# EAGLE design dds_ad9958 (EAGLE 6.5.0)
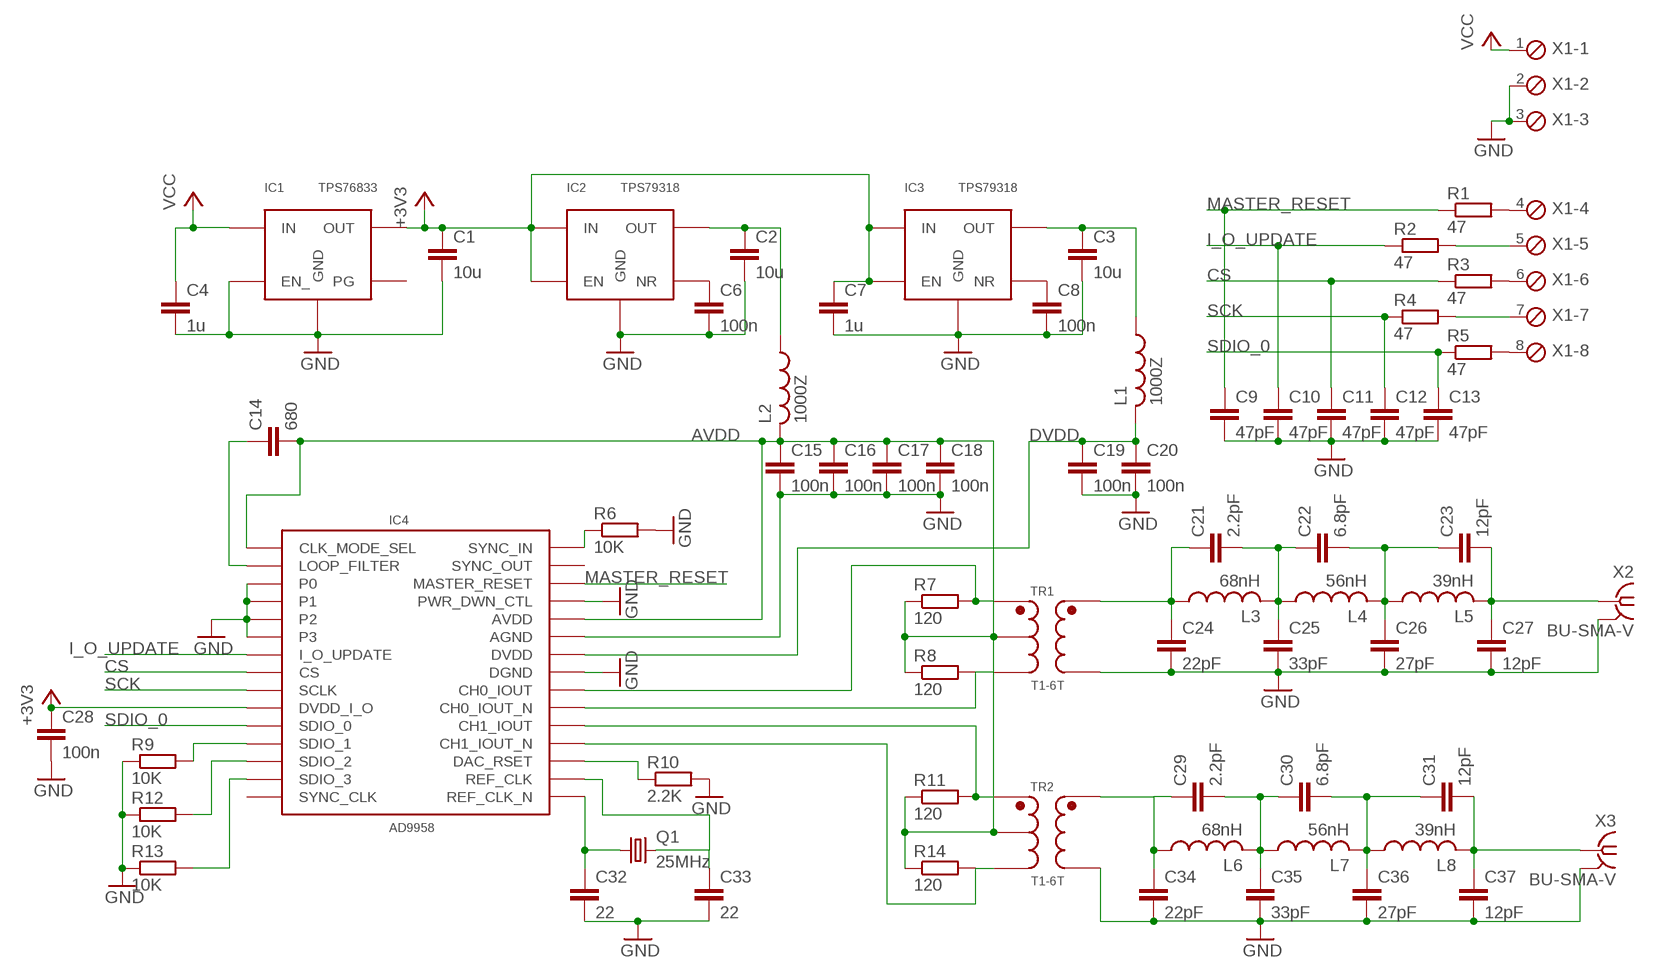
[diagram p0: schematic, sheet 1]

## Parts
C1  10u  C-EUC0805  [C0805]
C2  10u  C-EUC0805  [C0805]
C3  10u  C-EUC0805  [C0805]
C4  1u  C-EUC0603  [C0603]
C6  100n  C-EUC0603  [C0603]
C7  1u  C-EUC0603  [C0603]
C8  100n  C-EUC0603  [C0603]
C9  47pF  C-EUC0805  [C0805]
C10  47pF  C-EUC0805  [C0805]
C11  47pF  C-EUC0805  [C0805]
C12  47pF  C-EUC0805  [C0805]
C13  47pF  C-EUC0805  [C0805]
C14  680  C-EUC0805  [C0805]
C15  100n  C-EUC0603  [C0603]
C16  100n  C-EUC0603  [C0603]
C17  100n  C-EUC0603  [C0603]
C18  100n  C-EUC0603  [C0603]
C19  100n  C-EUC0603  [C0603]
C20  100n  C-EUC0603  [C0603]
C21  2.2pF  C-EUC0805  [C0805]
C22  6.8pF  C-EUC0805  [C0805]
C23  12pF  C-EUC0805  [C0805]
C24  22pF  C-EUC0805  [C0805]
C25  33pF  C-EUC0805  [C0805]
C26  27pF  C-EUC0805  [C0805]
C27  12pF  C-EUC0805  [C0805]
C28  100n  C-EUC0603  [C0603]
C29  2.2pF  C-EUC0805  [C0805]
C30  6.8pF  C-EUC0805  [C0805]
C31  12pF  C-EUC0805  [C0805]
C32  22  C-EUC0603  [C0603]
C33  22  C-EUC0603  [C0603]
C34  22pF  C-EUC0805  [C0805]
C35  33pF  C-EUC0805  [C0805]
C36  27pF  C-EUC0805  [C0805]
C37  12pF  C-EUC0805  [C0805]
IC1  TPS76833  TPS768XX  [SO8]
IC2  TPS79318  TPS793XX_FIXED  [SOT23-5]
IC3  TPS79318  TPS793XX_FIXED  [SOT23-5]
IC4  AD9958  [CP-56-1]
L1  1000Z  L-USL3225P  [L3225P]
L2  1000Z  L-USL3225P  [L3225P]
L3  68nH  L-USL0805  [C0805]
L4  56nH  L-USL0805  [C0805]
L5  39nH  L-USL0805  [C0805]
L6  68nH  L-USL0805  [C0805]
L7  56nH  L-USL0805  [C0805]
L8  39nH  L-USL0805  [C0805]
Q1  25MHz  CRYSTALHC49S  [HC49/S]
R1  47  R-EU_R0603  [R0603]
R2  47  R-EU_R0603  [R0603]
R3  47  R-EU_R0603  [R0603]
R4  47  R-EU_R0603  [R0603]
R5  47  R-EU_R0603  [R0603]
R6  10K  R-EU_R0603  [R0603]
R7  120  R-EU_R0603  [R0603]
R8  120  R-EU_R0603  [R0603]
R9  10K  R-EU_R0603  [R0603]
R10  2.2K  R-EU_R0603  [R0603]
R11  120  R-EU_R0603  [R0603]
R12  10K  R-EU_R0603  [R0603]
R13  10K  R-EU_R0603  [R0603]
R14  120  R-EU_R0603  [R0603]
TR1  T1-6T  [KK81]
TR2  T1-6T  [KK81]
X1  MPT8  [8POL254]
X2  BU-SMA-V  [BU-SMA-V]
X3  BU-SMA-V  [BU-SMA-V]

## Nets
+3V3: C1.1 C7.1 C28.1 IC1.5(OUT) IC1.6(OUT) IC2.1(IN) IC2.3(EN) IC3.1(IN) IC3.3(EN) IC4.P$49(DVDD_I_O)
AVDD: C14.2 C15.1 C16.1 C17.1 C18.1 IC4.P$5(AVDD) IC4.P$7(AVDD) IC4.P$11(AVDD) IC4.P$15(AVDD) IC4.P$19(AVDD) IC4.P$21(AVDD) IC4.P$24(CLK_MODE_SEL) IC4.P$26(AVDD) IC4.P$29(AVDD) IC4.P$30(AVDD) IC4.P$31(AVDD) IC4.P$33(AVDD) IC4.P$35(AVDD) IC4.P$36(AVDD) IC4.P$37(AVDD) IC4.P$39(AVDD) L2.2 R7.1 R8.1 R11.1 R14.1 TR1.P$2(SEC_CT) TR2.P$2(SEC_CT)
CS: C11.1 IC4.P$47(CS) R3.1
DVDD: C19.1 C20.1 IC4.P$45(DVDD) IC4.P$55(DVDD) L1.2
GND: C1.2 C2.2 C3.2 C4.2 C6.2 C7.2 C8.2 C9.2 C10.2 C11.2 C12.2 C13.2 C15.2 C16.2 C17.2 C18.2 C19.2 C20.2 C24.2 C25.2 C26.2 C27.2 C28.2 C32.2 C33.2 C34.2 C35.2 C36.2 C37.2 IC1.1(GND) IC1.2(EN_) IC2.2(GND) IC3.2(GND) IC4.P$4(PWR_DWN_CTL) IC4.P$6(AGND) IC4.P$10(AGND) IC4.P$12(AGND) IC4.P$16(AGND) IC4.P$18(AGND) IC4.P$20(AGND) IC4.P$25(AGND) IC4.P$40(P0) IC4.P$41(P1) IC4.P$42(P2) IC4.P$43(P3) IC4.P$44(DGND) IC4.P$56(DGND) IC4.PAD(AGND) R6.2 R9.1 R10.2 R12.1 R13.1 TR1.P$6(PRI) TR2.P$6(PRI) X1.2 X1.3 X2.2 X2.3 X2.4 X2.5 X3.2 X3.3 X3.4 X3.5
I_O_UPDATE: C10.1 IC4.P$46(I_O_UPDATE) R2.1
MASTER_RESET: C9.1 IC4.P$3(MASTER_RESET) R1.1
N$1: C32.1 IC4.P$22(REF_CLK_N) Q1.1
N$2: C21.1 C24.1 L3.1 TR1.P$4(PRI_DOT)
N$3: IC4.P$8(CH0_IOUT) R7.2 TR1.P$3(SEC_DOT)
N$4: C6.1 IC2.4(NR)
N$5: C8.1 IC3.4(NR)
N$6: C2.1 IC2.5(OUT) L2.1
N$7: IC4.P$9(CH0_IOUT_N) R8.2 TR1.P$1(SEC)
N$8: C3.1 IC3.5(OUT) L1.1
N$9: IC4.P$13(CH1_IOUT) R11.2 TR2.P$3(SEC_DOT)
N$10: IC4.P$14(CH1_IOUT_N) R14.2 TR2.P$1(SEC)
N$11: C21.2 C22.1 C25.1 L3.2 L4.1
N$12: IC4.P$17(DAC_RSET) R10.1
N$13: IC4.P$51(SDIO_1) R9.2
N$15: IC4.P$1(SYNC_IN) R6.1
N$16: C14.1 IC4.P$27(LOOP_FILTER)
N$17: C33.1 IC4.P$23(REF_CLK) Q1.2
N$18: C22.2 C23.1 C26.1 L4.2 L5.1
N$20: C23.2 C27.1 L5.2 X2.1
N$21: IC4.P$52(SDIO_2) R12.2
N$22: IC4.P$53(SDIO_3) R13.2
N$23: C29.1 C34.1 L6.1 TR2.P$4(PRI_DOT)
N$24: C29.2 C30.1 C35.1 L6.2 L7.1
N$25: C30.2 C31.1 C36.1 L7.2 L8.1
N$26: C31.2 C37.1 L8.2 X3.1
N$27: R3.2 X1.6
N$28: R5.2 X1.8
N$29: R1.2 X1.4
N$30: R2.2 X1.5
N$32: R4.2 X1.7
SCK: C12.1 IC4.P$48(SCLK) R4.1
SDIO_0: C13.1 IC4.P$50(SDIO_0) R5.1
VCC: C4.1 IC1.3(IN) IC1.4(IN) X1.1
Unconnected: IC1.8(PG) IC4.P$2(SYNC_OUT) IC4.P$54(SYNC_CLK)

## Library data of the parts
C1-C4 C6-C37 = rcl:C-EU: CAPACITOR, European symbol
IC1 = balmer:TPS768XX
IC2 IC3 = balmer:TPS793XX_FIXED: Voltage regulator, 200 ма
IC4 = balmer:AD9958: 500 MSPS DDS with 10-Bit DACs
L1-L8 = rcl:L-US: INDUCTOR, American symbol
Q1 = crystal:CRYSTAL: CRYSTAL; OC_FARNELL: 1667008; OC_NEWARK: unknown
R1-R14 = rcl:R-EU_: RESISTOR, European symbol
TR1 TR2 = balmer:T1-6T: T1-6T RF Transformer
X1 = con-phoenix-254:MPT8: PHOENIX CONNECTOR; OC_FARNELL: unknown; OC_NEWARK: unknown
X2 X3 = con-coax:BU-SMA-V: FEMALE SMA CONNECTOR Radiall distributor RS 112-3794; OC_FARNELL: unknown; OC_NEWARK: unknown

## Board
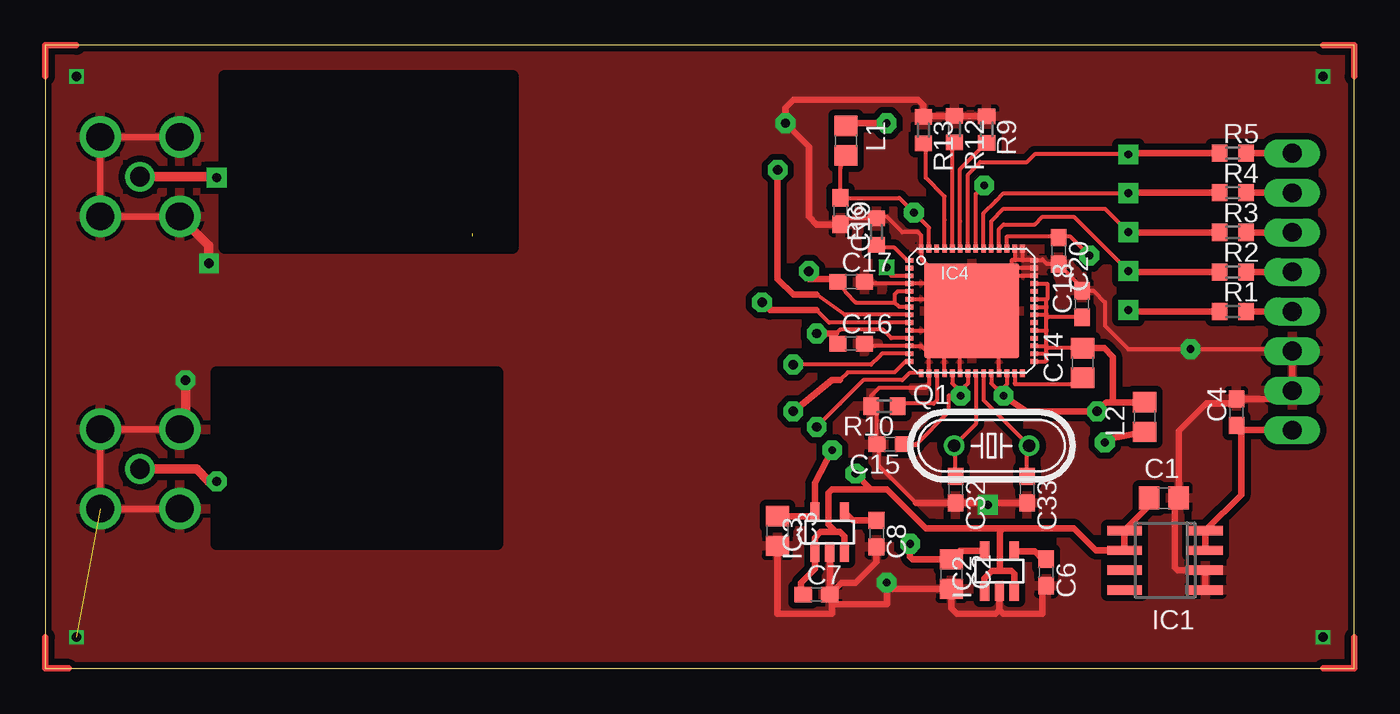
[diagram p1: board, top side]
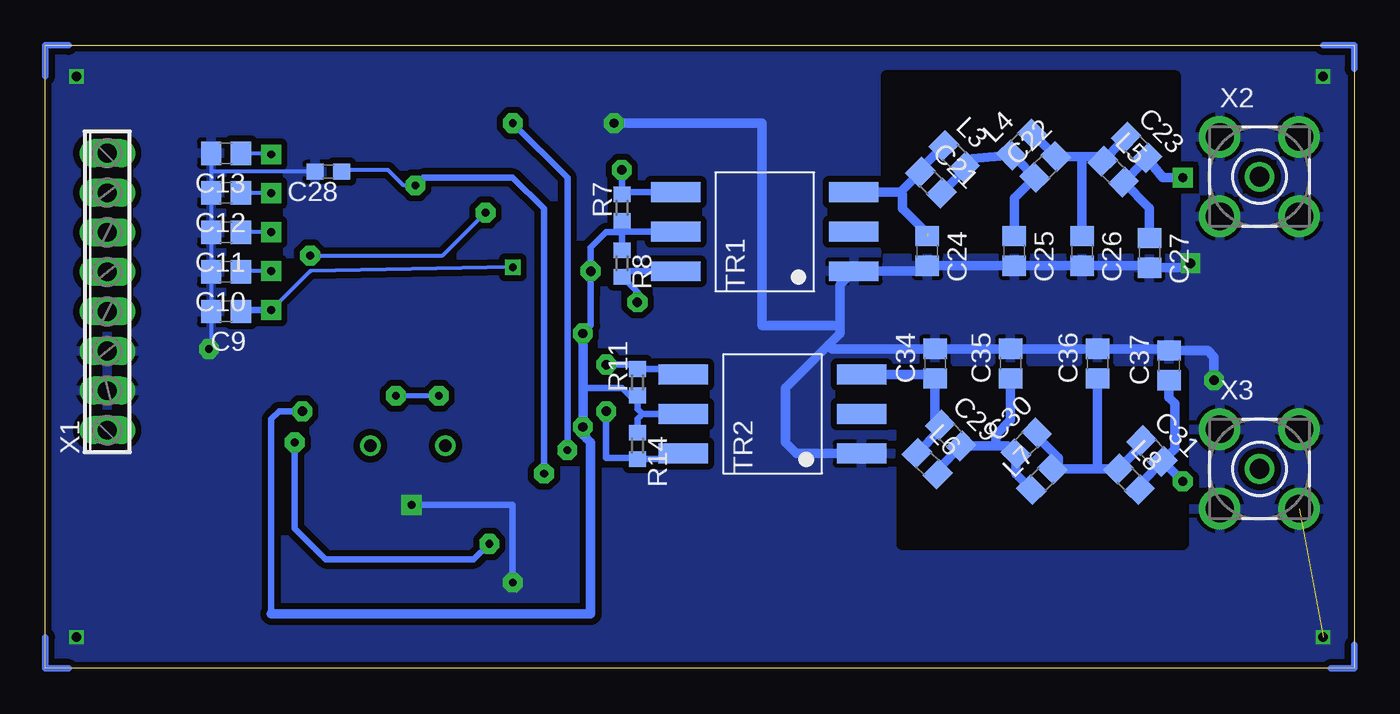
[diagram p2: board, bottom side, seen from below]

Size 84 x 40 mm. Coordinates in mm from the lower left corner, seen from the top.
Outline: 0,0 84,0 84,40 0,40 0,0
Copper layers (1*16): Top 0.035mm / dielectric 1.5mm / Bottom 0.035mm
Design rules "ITEADstudio_DRC": minimum track width 6mil, minimum drill 12mil, track to track 6mil, track to pad 6mil, pad to pad 6mil, via to via 6mil, smd to smd 0mil, copper to edge 10mil, drill to drill 10mil, minimum pad ring 10mil, minimum via ring 6mil, stop-mask expansion 2mil, vias tented up to drill 100mil, thermal gap 10mil
tRestrict: area 11.5,27 to 30,38; area 11,8 to 29,19
bRestrict: area 11.5,27 to 30,38; area 11,8 to 29,19

### Footprints (pad centres in the part's own frame; a part is rotated, then mirrored left to right if it is on the bottom)
C0805 = smd 1.3 x 1.5: 1 -0.95,0; 2 0.95,0
C0603 = smd 1.1 x 1: 1 -0.85,0; 2 0.85,0
SO8 = smd 0.6 x 2.2: 1 -1.905,-2.6; 2 -0.635,-2.6; 3 0.635,-2.6; 4 1.905,-2.6; 5 1.905,2.6; 6 0.635,2.6; 7 -0.635,2.6; 8 -1.905,2.6
SOT23-5 = smd 0.6 x 1.2: 1 -0.95,-1.306; 2 0,-1.306; 3 0.95,-1.306; 4 0.95,1.306; 5 -0.95,1.306
CP-56-1 = smd 0.5 x 0.3: P$1 -4,3.25; P$2 -4,2.75; P$3 -4,2.25; P$4 -4,1.75; P$5 -4,1.25; P$6 -4,0.75; P$7 -4,0.25; P$8 -4,-0.25; P$9 -4,-0.75; P$10 -4,-1.25; P$11 -4,-1.75; P$12 -4,-2.25; P$13 -4,-2.75; P$14 -4,-3.25; P$29 4,-3.25; P$30 4,-2.75; P$31 4,-2.25; P$32 4,-1.75; P$33 4,-1.25; P$34 4,-0.75; P$35 4,-0.25; P$36 4,0.25; P$37 4,0.75; P$38 4,1.25; P$39 4,1.75; P$40 4,2.25; P$41 4,2.75; P$42 4,3.25 | smd 0.3 x 0.5: P$15 -3.25,-4; P$16 -2.75,-4; P$17 -2.25,-4; P$18 -1.75,-4; P$19 -1.25,-4; P$20 -0.75,-4; P$21 -0.25,-4; P$22 0.25,-4; P$23 0.75,-4; P$24 1.25,-4; P$25 1.75,-4; P$26 2.25,-4; P$27 2.75,-4; P$28 3.25,-4; P$43 3.25,4; P$44 2.75,4; P$45 2.25,4; P$46 1.75,4; P$47 1.25,4; P$48 0.75,4; P$49 0.25,4; P$50 -0.25,4; P$51 -0.75,4; P$52 -1.25,4; P$53 -1.75,4; P$54 -2.25,4; P$55 -2.75,4; P$56 -3.25,4 | smd 6.1 x 6.1: PAD 0,0
HC49/S = drill 0.813: 1 -2.413,0; 2 2.413,0
R0603 = smd 1 x 1.1: 1 -0.85,0; 2 0.85,0
KK81 = smd 1.27 x 3.175: P$1 -2.54,5.715; P$2 0,5.715; P$3 2.54,5.715; P$4 2.54,-5.715; P$5 0,-5.715; P$6 -2.54,-5.715
8POL254 = drill 1.2 long: 1 -8.89,0; 2 -6.35,0; 3 -3.81,0; 4 -1.27,0; 5 1.27,0; 6 3.81,0; 7 6.35,0; 8 8.89,0
BU-SMA-V = drill 1.27: 1 0,0 | drill 1.778: 2 -2.55,2.55; 3 2.55,2.55; 4 2.55,-2.55; 5 -2.55,-2.55

### Placement (x,y rotation side)
C1  71.78,10.94 0 top
C2  58.15,6.05 270 top
C3  46.99,8.82 270 top
C4  76.44,16.44 90 top
C6  64.23,6.16 270 top
C7  49.49,4.74 0 top
C8  53.34,8.66 270 top
C9  72.4,22.91 180 bottom
C10  72.4,25.45 180 bottom
C11  72.4,27.99 180 bottom
C12  72.4,30.53 180 bottom
C13  72.4,33.07 180 bottom
C14  66.58,19.6 90 top
C15  54.22,14.39 180 top
C16  51.72,20.85 0 top
C17  51.72,24.81 0 top
C18  66.53,23.39 90 top
C19  51.03,29.35 270 top
C20  65.03,26.81 270 top
C21  27.17,31.19 315 bottom
C22  19.82,32.19 45 bottom
C23  13.97,33.44 315 bottom
C24  27.4,26.8 270 bottom
C25  21.82,26.8 270 bottom
C26  17.47,26.8 270 bottom
C27  13.14,26.67 270 bottom
C28  65.84,31.89 180 bottom
C29  25.9,14.95 315 bottom
C30  21.05,14.45 45 bottom
C31  12.97,13.95 315 bottom
C32  58.42,11.48 270 top
C33  63,11.48 270 top
C34  26.9,19.56 90 bottom
C35  22.05,19.56 90 bottom
C36  16.47,19.56 90 bottom
C37  11.89,19.45 90 bottom
IC1  71.86,6.94 90 top
IC2  61.23,6.24 0 top
IC3  50.34,8.74 0 top
IC4  59.46,22.95 0 top
L1  1000Z  [C0805]  51.38,33.88 270 top
L2  1000Z  [C0805]  70.54,16.13 90 top
L3  25.67,32.88 315 bottom
L4  21.32,33.63 45 bottom
L5  15.47,31.88 315 bottom
L6  27.4,13.14 315 bottom
L7  20.05,12.14 45 bottom
L8  14.47,12.14 315 bottom
Q1  60.73,14.29 0 top
R1  76.21,22.91 0 top
R2  76.21,25.45 0 top
R3  76.21,27.99 0 top
R4  76.21,30.53 0 top
R5  76.21,33.07 0 top
R6  53.34,28.03 90 top
R7  46.99,29.57 90 bottom
R8  46.99,25.99 270 bottom
R9  60.41,34.59 270 top
R10  53.84,16.83 180 top
R11  45.99,18.37 90 bottom
R12  58.35,34.61 270 top
R13  56.35,34.55 270 top
R14  45.99,14.29 270 bottom
TR1  37.83,28.03 90 bottom
TR2  37.33,16.33 90 bottom
X1  80.02,24.18 90 bottom
X2  6.08,31.56 0 bottom
X3  6.08,12.8 0 bottom

### Tracks (layer width: path | path; a pad name or v marks a point on that pad's centre or on a via)
+3V3  (via drill 0.5 pad 1.27)
  Top 0.25: IC4.P$49 59.71,30.46 v60.25,31
  Top 0.406: 51,8.75 51.29,8.46 IC3.3 | 51,8.75 49.75,8.75 49.39,8.39 IC3.1 49.39,6.39 48.5,5.5 48.5,4.88 C7.1 | 51,8.75 50.75,8.75 50.25,9.25 50.25,11.25 50.5,11.5 54,11.5 | C1.1 70.83,10.41 IC1.5 IC1.6 67.42,7.58 66,9 61.5,9 | 61.5,9 60.5,9 59,9 57,9 56.5,9 54,11.5 | 54,11.5 53,11.5 v52,12.5 | IC2.3 62.18,6.07 62,6.25 61.25,6.25 | 61.25,6.25 61.25,8.75 61.5,9 | IC2.1 60.28,5.78 60.5,6 60.75,6.25 61.25,6.25
  Bottom 0.25: v60.25,31 61,31 62,32 64.88,32 C28.1
  Bottom 0.406: v52,12.5 52,29.5 54,31.5 59.75,31.5 v60.25,31
AVDD  (via drill 0.5 pad 1.27, 0.6 pad 1.27)
  Top 0.25: IC4.P$5 54.7,24.2 54.5,24 54.5,23.5 | IC4.P$7 54.8,23.2 54.5,23.5 | IC4.P$19 58.21,18.29 58.5,18 | IC4.P$21 59.21,18.29 59,18.08 59,18 | C17.1 51.37,24.13 52,23.5 54.5,23.5 | 55.89,14.39 58,16.5 58,17.5 | IC4.P$11 54.3,21.2 53.75,21.75 51,21.75 50.75,21.5 50.75,20.97 C16.1 | IC4.P$37 64.2,23.7 64.25,23.65 64.25,23.25 64.2,23.2 | IC4.P$39 64.3,24.7 | IC4.P$36 64.2,23.2 | IC4.P$35 64.2,22.7 | 64.2,22.7 64.25,22.75 64.25,23.15 64.2,23.2 | IC4.P$33 64.2,21.7 | 64.2,21.7 64.25,21.75 64.25,22.65 | 64.25,22.65 64.2,22.7 | IC4.P$31 64.2,20.7 | 64.2,20.7 64.25,20.75 64.25,21.65 64.2,21.7 | IC4.P$30 64.2,20.2 | 64.2,20.2 64.25,20.25 64.25,20.5 | 64.25,20.5 64.25,20.65 64.2,20.7 | IC4.P$29 64.2,19.7 64.25,19.75 64.25,20.15 64.2,20.2 | IC4.P$24 60.71,18.29 61,18 61.5,18 61.71,18.21 IC4.P$26 | C14.2 64.3,20.55 64.25,20.5 | C18.1 64.36,22.54 64.25,22.65 | IC4.P$15 55.45,18.95 55,18.5 52.5,18.5
  Top 0.254: 64.3,24.7 64.3,23.7 64.25,23.65 | 52.5,18.5 51,17 v49.5,15.5
  Top 0.305: C15.1 55.89,14.39 | 59,18 59,17.75 v58.75,17.5 | 58,17.5 v58.75,17.5 | 58.5,18 58.5,17.75 v58.75,17.5 | v61.5,17.5 61.5,18
  Top 0.406: C17.1 50.68,25 49,25 v49,25.5 | v61.5,17.5 63,16.5 v67.5,16.5 68,17 68.08,17.08 68.5,17.08 | 50.75,21.5 v49.5,21.5 | L2.2 68.5,17.08 | C14.2 67.95,20.55 68.5,20 68.5,17.08
  Bottom 0.305: v58.75,17.5 v61.5,17.5
  Bottom 0.406: v67.5,16.5 69,16.5 69.5,16 69.5,3.5 | R7.1 46.99,28 | 46.99,28 R8.1 | 46.99,28 48,28 49,27 v49,25.5 49,24 49,22 v49.5,21.5 | TR1.P$2 46.96,28.03 46.99,28 | R14.1 45.99,16 45.66,16.33 | TR2.P$2 45.66,16.33 | 45.66,16.33 45.99,16.66 R11.1 46.52,17.52 47,18 49.5,18
  Bottom 0.61: 69.5,3.5 49,3.5 49,14.5 49.25,14.75 | 49.5,15 49.25,14.75 | 49.5,15 v49.5,15.5 49.5,18 v49.5,21.5 | 49.5,15 49.25,14.75
CS  (via drill 0.5 pad 1.27)
  Top 0.25: v69.51,27.99 v69.5,28 68,29.5 61.5,29.5 60.71,28.71 IC4.P$47
  Top 0.406: R3.1 v69.51,27.99
  Bottom 0.25: v69.5,28 C11.1
DVDD  (via drill 0.5 pad 1.27)
  Top 0.25: IC4.P$45 61.71,27.71 61.75,27.75 64.94,27.75 | 64.94,27.75 C20.1 64.94,27.75 | 64.94,27.75 65.75,27.75 v67,26.5 | IC4.P$55 56.71,28.29 56.5,28.5 v55.75,29.25 54.8,30.2 C19.1 51.03,32.13 L1.2
  Bottom 0.25: v67,26.5 58.5,26.5 v55.75,29.25
GND  (via drill 0.5 pad 1.27, 0.6, 0.6 pad 1.27)  (1 unrouted)
  Top 0.25: IC4.P$40 60.73,25.2 | 60.73,25.2 59.46,25.2 59.46,25 | 59.46,25 IC4.PAD 57.51,21 | IC4.P$41 62,25.7 62,25.49 | 62,25.49 60.73,25.49 60.73,25.2 | 62.75,26.2 IC4.P$42 63.95,26.2 64,26.25 64.29,25.96 C20.2 66.53,24.46 C18.2 67.26,24.24 68,23.5 68,22 69.5,20.5 v73.5,20.5 79.89,20.5 X1.3 | 62.75,26.2 62.25,26.2 | 62.25,26.2 62,26.2 62,25.49 | IC4.P$43 62.71,26.24 62.75,26.2 | IC4.P$44 62.21,26.24 62.25,26.2 | 57,25.5 56.5,26 56.21,26.29 IC4.P$56 56.21,27.79 56,28 | 57,25.5 58.96,25.5 59.46,25 | 56.7,24.7 57,25 57,25.5 | 56.71,20.2 IC4.P$16 56.71,18.21 56.5,18 53.5,18 53,17.5 R10.2 53.37,16.45 C15.2 53.5,14.26 53.5,13 55.87,10.63 C32.2 | 56.71,20.2 57.51,21 | 56.71,20.2 56.21,20.7 IC4.P$12 54.8,20.7 52.72,20.7 C16.2 | IC4.P$10 56.8,21.7 57.51,21 | IC4.P$6 56.7,23.7 57,24 57,24.4 56.7,24.7 | IC4.P$20 58.71,20.29 | 58.71,20.29 58.5,20.5 58,20.5 | 58,20.5 57.51,21 | IC4.P$18 57.71,20.21 58,20.5 | 56.7,24.7 IC4.P$4 52.68,24.7 C17.2 | 51.15,28.38 C19.2 51.41,28.88 R6.2 | IC4.P$25 61.21,20.29 61,20.5 58.92,20.5 58.71,20.29
  Top 0.254: 56,28 55,28 54,29
  Top 0.406: C19.2 49.5,28.5 49,29 49,33 49,33.5 v47.5,35 47.5,36 48,36.5 56,36.5 56.35,36.15 R13.1 56.41,35.46 R12.1 58.37,35.44 R9.1 | IC3.2 C7.2 | C8.2 53.34,6.84 52,5.5 51.1,5.5 C7.2 | C3.2 46.99,3.51 47,3.5 50.5,3.5 50.5,4 | 50.5,4 50.5,4.58 C7.2 | 50.5,4 50.6,4.1 54,4.1 54,4.5 54,5 | X1.3 X1.2 79.48,17.29 C4.2 76.15,17 74.5,17 72.73,15.23 C1.2 72.5,10.71 72.5,6.5 72.69,6.3 IC1.2 IC1.1 | C33.2 60.63,10.63 v60.5,10.5 60.37,10.63 55.87,10.63 | v54,5.5 54,5 | X3.2 X3.3 X3.4 X3.5 | X2.2 X2.3 X2.4 X2.5 | IC2.2 61.23,3.77 | 61.23,3.77 61.5,3.5 64,3.5 64,5.08 C6.2 | 61.23,3.77 60.96,3.5 58.5,3.5 58.15,3.85 C2.2 54.1,5.1 54,5
  Top 0.61: v10.5,26 10.5,27.14 X2.5 | v9,18.5 9,15.72 X3.2
  Bottom 0.25: C13.2 73.35,32 | 73.35,32 C12.2 C11.2 C10.2 C9.2 73.35,20.65 v73.5,20.5 | C28.2 73.24,31.89 73.35,32
  Bottom 0.406: v60.5,10.5 54,10.5 v54,5.5
  Bottom 0.61: v10.5,26 10.78,25.72 C27.2 13.27,25.85 C26.2 C25.2 C24.2 27.76,25.49 TR1.P$6 33,24.61 33,22 | TR2.P$6 35.79,13.79 36.5,14.5 36.5,18 33.75,20.75 | 33.75,20.75 33,21.5 33,22 | 33.75,20.75 33.51,20.51 C34.2 C35.2 C36.2 12,20.51 C37.2 9.4,20.4 9,20 v9,18.5 | v47.5,35 38,35 38,22 33,22
  other vias: 2,38 82,38 82,2 2,2
  pour Top (isolate 0.406): 0,40 84,40 84,0 0,0
  pour Bottom (isolate 0.406): 0,40 84,40 84,0 0,0
I_O_UPDATE  (via drill 0.5 pad 1.27)
  Top 0.25: 69.55,25.45 v69.5,25.5 68,27 66,29 64,29 63.5,28.5 61.5,28.5 61.21,28.21 IC4.P$46
  Top 0.406: R2.1 69.55,25.45
  Bottom 0.25: v69.5,25.5 71.4,25.5 C10.1
MASTER_RESET  (via drill 0.5 pad 1.02, 0.5 pad 1.27)
  Top 0.25: IC4.P$3 54.3,25.2 v54,25.75
  Top 0.406: R1.1 69.59,22.91 v69.5,23
  Bottom 0.25: v54,25.75 67,25.5 v69.5,23
  Bottom 0.406: v69.5,23 71.36,23 C9.1
N$1
  Top 0.25: C32.1 58.42,14.19 Q1.1 59.71,15.68 IC4.P$22
N$2  (1 unrouted)
  Bottom 0.61: TR1.P$4 29.13,30.57 | 29.13,30.57 C21.1 27.84,32.05 L3.1 | 29.13,30.57 29,30.44 29,29.5 27.4,27.9
N$3  (via drill 0.6 pad 1.27)
  Top 0.25: IC4.P$8 51.3,22.7 49.5,24
  Top 0.406: 49.5,24 48,24 47,25 v47,32
  Bottom 0.406: v47,32 R7.2 46.84,30.57 TR1.P$3
N$4
  Top 0.406: C6.1 63.99,7.01 63.5,7.5 62.23,7.5 IC2.4
N$5
  Top 0.406: C8.1 51.83,9.51 IC3.4
N$6  (via drill 0.5 pad 1.27)
  Top 0.406: L2.1 68.23,14.73 v68,14.5 | v55.5,8 55.5,7.15 55.65,7 C2.1 58.7,7.55 IC2.5
  Bottom 0.406: v68,14.5 68,9 66,7 56.5,7 v55.5,8
N$7  (via drill 0.6 pad 1.27)
  Top 0.25: IC4.P$9 50.3,22.2 49.5,23
  Top 0.406: 49.5,23 46.5,23 v46,23.5
  Bottom 0.406: v46,23.5 46,24.15 R8.2 46.64,25.49 TR1.P$1
N$8  (via drill 0.5 pad 1.27)
  Top 0.406: C3.1 49.11,9.77 IC3.5 49.39,11.89 v50.5,14 | v54,35 51.66,35 L1.1
  Bottom 0.406: v50.5,14 50.5,31.5 v54,35
N$9  (via drill 0.6 pad 1.27)
  Top 0.254: IC4.P$13 53.7,20.2 53.5,20 53,19.5 v48,19.5
  Bottom 0.406: v48,19.5 46.27,19.5 R11.2 43.4,19.22 TR2.P$3
N$10  (via drill 0.6 pad 1.27)
  Top 0.254: IC4.P$14 55.2,19.7 54.5,19 51.5,19 51,18.5
  Top 0.406: v48,16.5 50.5,18.5 51,18.5
  Bottom 0.406: v48,16.5 48,16 48,13.5 46.55,13.5 R14.2 43.4,13.44 TR2.P$1
N$11
  Bottom 0.61: C21.2 25,32.02 L3.2 24.5,32.71 L4.1 21.68,32.71 C22.1 21.82,30.19 C25.1
N$12
  Top 0.25: IC4.P$17 57.21,17.21 57,17 54.86,17 R10.1
N$13
  Top 0.25: IC4.P$51 58.71,28.71 58.71,32.04 R9.2
N$14
  Top 0.406: 1.5,0 0,0 0,2
N$15
  Top 0.25: IC4.P$1 55.3,26.2 54.5,27 53.52,27 R6.1
N$16
  Top 0.25: IC4.P$27 62.21,18.29 62.25,18.25 66.18,18.25 C14.1
N$17
  Top 0.25: IC4.P$23 60.21,17.22 Q1.2 63,14.15 C33.1
N$18
  Bottom 0.61: L4.2 20.34,34.05 C22.2 17.5,32.86 | 17.5,32.86 16.45,32.86 L5.1 14.83,33.86 C23.1 | C26.1 17.47,32.83 17.5,32.86
N$19
  Top 0.406: 2,40 0,40 0,38
N$20  (via drill 0.6 pad 1.27)
  Top 0.61: X2.1 10.94,31.56 v11,31.5
  Bottom 0.61: v11,31.5 12.28,31.5 C23.2 13.49,32.52 L5.2 13.14,29.55 C27.1
N$21
  Top 0.25: IC4.P$52 58.21,33.62 R12.2
N$22
  Top 0.25: IC4.P$53 57.71,28.79 57.71,30.29 56.5,31.5 56.5,33.55 | 56.5,33.55 R13.2 56.5,33.55
N$23
  Bottom 0.61: TR2.P$4 27.16,18.87 C34.1 26.9,15.95 C29.1 26.57,15.31 L6.1
N$24
  Bottom 0.61: L6.2 26.73,12.78 C29.2 23,14.28 | 23,14.28 22.22,14.28 C30.1 21.72,12.47 L7.1 | C35.1 22.05,15.95 23,15 23,14.28
N$25
  Bottom 0.61: C30.2 20.38,14.88 19,13.5 19,13.19 L7.2 16.5,12.81 | 16.5,12.81 L8.1 13.64,14.31 C31.1 | C36.1 16.47,12.84 16.5,12.81
N$26  (via drill 0.6 pad 1.27)
  Top 0.61: v11,12 10.5,12 9.7,12.8 X3.1
  Bottom 0.61: L8.2 13.8,11.78 C31.2 | C37.1 11.89,17.39 11.5,17 11.5,14.08 C31.2 | C31.2 12.28,13.28 v11,12
N$27
  Top 0.406: R3.2 X1.6
N$28
  Top 0.406: R5.2 X1.8
N$29
  Top 0.406: R1.2 X1.4
N$30
  Top 0.406: R2.2 X1.5
N$31
  Top 0.406: 82,40 84,40 84,38
N$32
  Top 0.406: R4.2 X1.7
N$33
  Top 0.406: 82,0 84,0 84,2
N$34
  Bottom 0.406: 2,40 0,40 0,38.5
N$35
  Bottom 0.406: 1.5,0 0,0 0,1.5
N$36
  Bottom 0.406: 82.5,40 84,40 84,38
N$37
  Bottom 0.406: 82.5,0 84,0 84,2
SCK  (via drill 0.5 pad 1.27)
  Top 0.25: 69.53,30.53 v69.5,30.5 61.5,30.5 61,30 60.21,29.21 IC4.P$48
  Top 0.406: R4.1 69.53,30.53
  Bottom 0.25: v69.5,30.5 71.42,30.5 C12.1
SDIO_0  (via drill 0.5 pad 1.27)
  Top 0.25: IC4.P$50 59.21,31.71 60,32.5 63,32.5 63.5,33 v69.5,33 69.57,33.07
  Top 0.406: R5.1 69.57,33.07
  Bottom 0.25: C13.1 69.57,33.07 v69.5,33
VCC
  Top 0.406: X1.1 76.74,15.29 | 76.74,15.29 C4.1 | 76.74,15.29 76.74,11.12 IC1.4 IC1.3